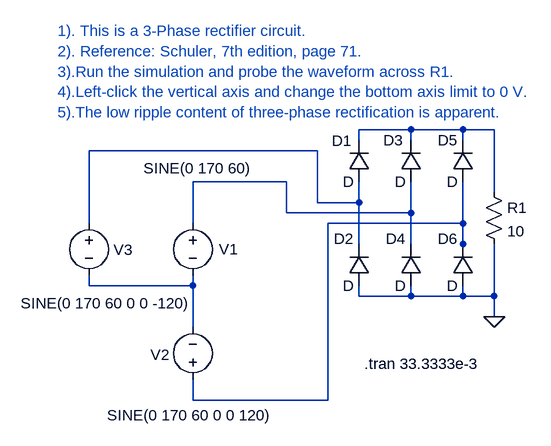
[diagram p0: schematic 3PhaseRect.asc]
3PhaseRect.asc, the LTspice schematic file:
Version 4
SHEET 1 932 680
WIRE 416 48 336 48
WIRE 496 48 416 48
WIRE 544 48 496 48
WIRE 336 64 336 48
WIRE 416 64 416 48
WIRE 496 64 496 48
WIRE 272 80 -80 80
WIRE 224 128 80 128
WIRE 544 144 544 48
WIRE 272 160 272 80
WIRE 336 160 336 128
WIRE 336 160 272 160
WIRE 224 176 224 128
WIRE 416 176 416 128
WIRE 416 176 224 176
WIRE -80 192 -80 80
WIRE 80 192 80 128
WIRE 496 192 496 128
WIRE 496 192 288 192
WIRE 336 224 336 160
WIRE 416 224 416 176
WIRE 496 224 496 192
WIRE 496 240 496 224
WIRE -80 288 -80 272
WIRE 80 288 80 272
WIRE 80 288 -80 288
WIRE 336 304 336 288
WIRE 416 304 416 288
WIRE 416 304 336 304
WIRE 496 304 496 288
WIRE 496 304 416 304
WIRE 544 304 544 224
WIRE 544 304 496 304
WIRE 544 336 544 304
WIRE 80 352 80 288
WIRE 80 464 80 432
WIRE 288 464 288 192
WIRE 288 464 80 464
FLAG 544 336 0
SYMBOL voltage 80 176 R0
WINDOW 3 -76 -69 Left 2
WINDOW 123 0 0 Left 2
WINDOW 39 0 0 Left 2
WINDOW 0 40 56 Left 2
SYMATTR Value SINE(0 170 60)
SYMATTR InstName V1
SYMBOL voltage -80 176 R0
WINDOW 3 -105 139 Left 2
WINDOW 123 0 0 Left 2
WINDOW 39 0 0 Left 2
WINDOW 0 38 57 Left 2
SYMATTR Value SINE(0 170 60 0 0 -120)
SYMATTR InstName V3
SYMBOL res 528 128 R0
SYMATTR InstName R1
SYMATTR Value 10
SYMBOL voltage 80 448 R180
WINDOW 0 36 54 Left 2
WINDOW 3 -122 -39 Left 2
WINDOW 123 0 0 Left 2
WINDOW 39 0 0 Left 2
SYMATTR InstName V2
SYMATTR Value SINE(0 170 60 0 0 120)
SYMBOL diode 352 128 R180
WINDOW 0 27 63 Left 2
WINDOW 3 24 0 Left 2
SYMATTR InstName D1
SYMBOL diode 352 288 R180
WINDOW 0 24 72 Left 2
WINDOW 3 24 0 Left 2
SYMATTR InstName D2
SYMBOL diode 432 128 R180
WINDOW 0 28 64 Left 2
WINDOW 3 24 0 Left 2
SYMATTR InstName D3
SYMBOL diode 432 288 R180
WINDOW 0 24 72 Left 2
WINDOW 3 24 0 Left 2
SYMATTR InstName D4
SYMBOL diode 512 128 R180
WINDOW 0 24 64 Left 2
WINDOW 3 24 0 Left 2
SYMATTR InstName D5
SYMBOL diode 512 288 R180
WINDOW 0 24 72 Left 2
WINDOW 3 24 0 Left 2
SYMATTR InstName D6
TEXT 344 408 Left 2 !.tran 33.3333e-3
TEXT -128 -104 Left 2 ;1). This is a 3-Phase rectifier circuit.\n2). Reference: Schuler, 7th edition, page 71.\n3).Run the simulation and probe the waveform across R1.\n4).Left-click the vertical axis and change the bottom axis limit to 0 V.\n5).The low ripple content of three-phase rectification is apparent.

The netlist it stands for:
* 3PhaseRect.asc
V1 N003 N005 SINE(0 170 60)
V3 N002 N005 SINE(0 170 60 0 0 -120)
R1 N001 0 10
V2 N004 N005 SINE(0 170 60 0 0 120)
D1 N002 N001 D
D2 0 N002 D
D3 N003 N001 D
D4 0 N003 D
D5 N004 N001 D
D6 0 N004 D
.model D D
.lib standard.dio
.tran 33.3333e-3
* 1). This is a 3-Phase rectifier circuit.
* 2). Reference: Schuler, 7th edition, page 71.
* 3).Run the simulation and probe the waveform across R1.
* 4).Left-click the vertical axis and change the bottom axis limit to 0 V.
* 5).The low ripple content of three-phase rectification is apparent.
.backanno
.end